# Altium schematic sheet COMS0003_DTMF.SchDoc: BLUEsat DTMF receiver
size A3; DrawnBy: Thomas Fisk; Engineer: T. FISK; Organization: BLUEsat Project; Address1: Room 419; Address2: School of EE&T; Address3: UNSW, NSW 2052; Address4: Australia; DocumentNumber: COMS0003; SheetNumber: 1; SheetTotal: 1; Description: DTMF Reciever based on Zarlink MT88L70 IC; Version: 1.0
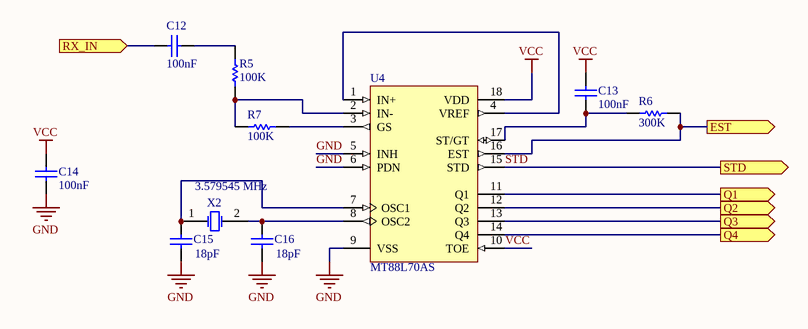
[diagram p0: COMS0003_DTMF.SchDoc]

## Parts
C12  value 100nF  [CAPC2012M]  (hidden comment: Cap)
C13  value 100nF  [CAPC2012M]  (hidden comment: Cap)
C14  value 100nF  [CAPC2012M]  (hidden comment: Cap)
C15  value 18pF  [CAPC2012M]  (hidden comment: Cap)
C16  value 18pF  [CAPC2012M]  (hidden comment: Cap)
R5  value 100K  [RESC2012M]  (hidden comment: Res1)
R6  value 300K  [RESC2012M]  (hidden comment: Res1)
R7  value 100K  [RESC2012M]  (hidden comment: Res1)
U4  MT88L70AS  [SOIC18_N]
X2  3.579545 MHz  [CSM-7]

## Ports
EST (out), Q1 (out), Q2 (out), Q3 (out), Q4 (out), RX_IN (in), STD (out)

## Nets
GND: C14.2 C15.2 C16.2 U4.5(INH) U4.6(PDN) U4.9(VSS)
VCC: C13.2 C14.1 U4.10(TOE) U4.18(VDD)
EST: R6.1 U4.16(EST) ; port EST
Q1: U4.11(Q1) ; port Q1
Q2: U4.12(Q2) ; port Q2
Q3: U4.13(Q3) ; port Q3
Q4: U4.14(Q4) ; port Q4
RX_IN: C12.2 ; port RX_IN
STD: U4.15(STD) ; port STD
NetC12_1: C12.1 R5.2
NetC13_1: C13.1 R6.2 U4.17(ST/GT)
NetC15_1: C15.1 U4.7(OSC1) X2.1(OSC1)
NetC16_1: C16.1 U4.8(OSC2) X2.2(OSC2)
NetR5_1: R5.1 R7.2 U4.2(IN-)
NetR7_1: R7.1 U4.3(GS)
NetU4_1: U4.1(IN+) U4.4(VREF)

## Notes on the sheet
- Title
- Description:
- Size:
- Author:
- Date:
- A3
- Time:
- Version
- Sheet:
- Drawing No.:
- of
- File:

## Library data of the parts
C12-C16 = Cap: Capacitor; Published: 8-Jun-2000; LatestRevisionDate: 17-Jul-2002; LatestRevisionNote: Re-released for DXP Platform.; PackageReference: RAD-0.3; Publisher: Altium Limited; PackageDescription: Radial Cap, Thru-Hole; 2 Leads; 0.3 in Pin Spacing; Supplier 1: Farnell; Supplier Part Number 1: 1759143
R5-R7 = Res1: Resistor; Published: 8-Jun-2000; LatestRevisionDate: 17-Jul-2002; LatestRevisionNote: Re-released for DXP Platform.; PackageReference: AXIAL-0.3; Publisher: Altium Limited; PackageDescription: Axial Device, Thru-Hole; 2 Leads; 0.3 in Pin Spacing; Supplier 1: Farnell
  R5 R7: Supplier Part Number 1: 1759143RL; Supplier 2: Farnell; Supplier Part Number 2: 1887334
  R6: Supplier Part Number 1: 1887346
U4 = MT88L70AS: 3 Volt Integrated DTMF Receiver; Published: 8-Jun-2000; LatestRevisionDate: 13-Apr-2006; LatestRevisionNote: IPC-7351 Footprint Added.; DatasheetVersion: Issue 4 March 1997; PackageVersion: 1997; PackageReference: SOIC18; Publisher: Altium Limited; PackageDescription: 18-Pin Small Outline Integrated Circuit 1.27 mm Pitch; Code_JEDEC: MS-013-AB; ComponentLink1Description: Manufacturer Link; ComponentLink1URL: http://products.zarlink.com; ComponentLink2Description: Datasheet; ComponentLink2URL: http://assets.zarlink.com/DS/zarlink_MT88L70_MAY_05.pdf; Supplier 1: Allied; Supplier Part Number 1: 090-SPEC
X2 = ECS-110-S-5P: Crystal Oscillator; Published: 17-Jul-2002; DatasheetDocument: 18-Apr-2000; PackageReference: CSM-7; Publisher: Altium Limited; ComponentLink1Description: Manufacturer Link; ComponentLink1URL: http://www.ecsxtal.com/; ComponentLink2Description: Datasheet; ComponentLink2URL: http://www.ecsxtal.com/pdf3/CSM_7.pdf; Supplier 1: Farnell; Supplier Part Number 1: 1079073